# Altium schematic sheet SCH_AP-Button_LED_Sheet_V2_Altium.schdoc
size 191 x 139 mm
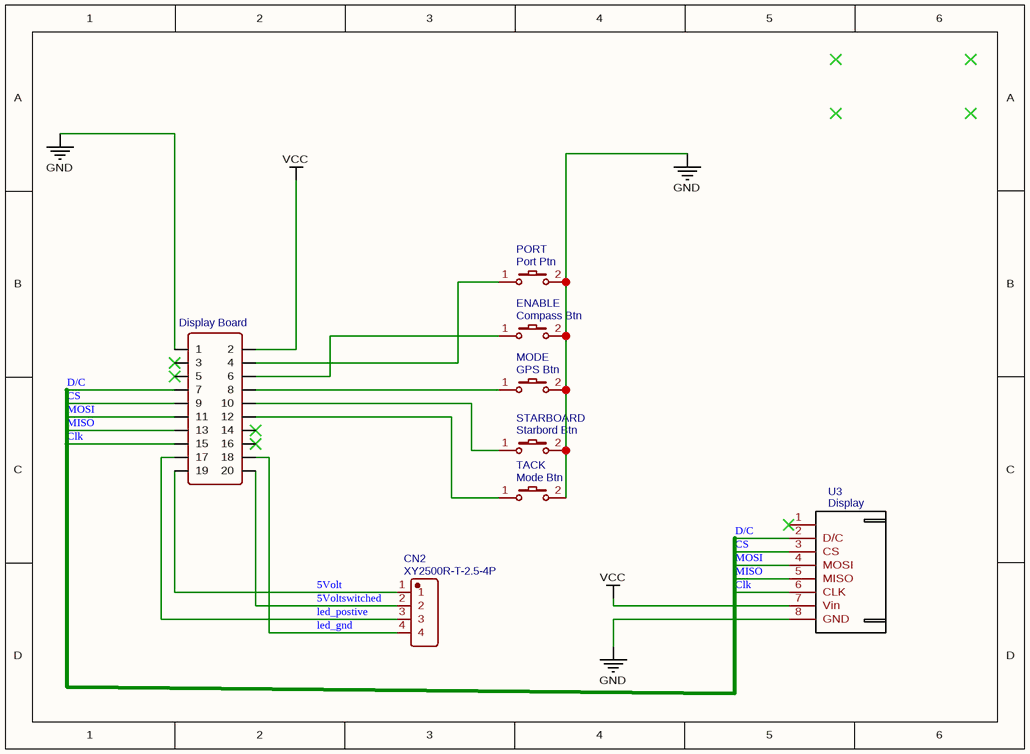
[diagram p0: SCH_AP-Button_LED_Sheet_V2_Altium.schdoc]

## Parts
BUTTON_LED1  Display Board  [HDR-M-2.54_2X10]
CN2  XY2500R-T-2.5-4P  [CONN-TH_XY2500R-T-2.5-4P]
ENABLE  Compass Btn  [KEY-SMD_2P-L6.2-W3.6-LS8.0]
MODE  GPS Btn  [KEY-SMD_2P-L6.2-W3.6-LS8.0]
PORT  Port Ptn  [KEY-SMD_2P-L6.2-W3.6-LS8.0]
STARBOARD  Starbord Btn  [KEY-SMD_2P-L6.2-W3.6-LS8.0]
TACK  Mode Btn  [KEY-SMD_2P-L6.2-W3.6-LS8.0]
U3  Display  [JST-XH-8-PIN]

## Nets
GND: BUTTON_LED1.1 ENABLE.2 MODE.2 PORT.2 STARBOARD.2 TACK.2 U3.8(GND)
VCC: BUTTON_LED1.2 U3.7(Vin)
5Volt: BUTTON_LED1.19 CN2.1
5Voltswitched: BUTTON_LED1.20 CN2.2
Clk: BUTTON_LED1.15 U3.6(CLK)
CS: BUTTON_LED1.9 U3.3(CS)
D/C: BUTTON_LED1.7 U3.2(D/C)
led_gnd: BUTTON_LED1.18 CN2.4
led_postive: BUTTON_LED1.17 CN2.3
MISO: BUTTON_LED1.13 U3.5(MISO)
MOSI: BUTTON_LED1.11 U3.4(MOSI)
NetBUTTON_LED1_4: BUTTON_LED1.4 PORT.1
NetBUTTON_LED1_6: BUTTON_LED1.6 ENABLE.1
NetBUTTON_LED1_8: BUTTON_LED1.8 MODE.1
NetBUTTON_LED1_10: BUTTON_LED1.10 STARBOARD.1
NetBUTTON_LED1_12: BUTTON_LED1.12 TACK.1

Not connected (* = marked no-connect by the designer): BUTTON_LED1 3* 5* 14* 16*; U3 1*

## Library data of the parts
BUTTON_LED1 = Display Board: Contributor: LCEDA_Lib; Supplier Part: C124359; Supplier: LCSC; spicePre: J; spiceSymbolName: HDR-M-2.54_2x10
CN2 = XY2500R-T-2.5-4P: Manufacturer: XINLAIYA(新莱亚); Contributor: LCSC; Supplier: LCSC; Supplier Part: C784963; Manufacturer Part: XY2500R-T-2.5-4P; JLCPCB Part Class: Extended Part; spicePre: C; spiceSymbolName: XY2500R-T-2.5-4P
ENABLE = Compass Btn: Manufacturer Part: K2-1107ST-A4SW-06; Contributor: LCEDA_Lib; 制造商: 韩国韩荣; Supplier Part: C118141; Supplier: LCSC; spicePre: K; spiceSymbolName: K2-3.6×6.1_SMD
MODE = GPS Btn: Manufacturer Part: K2-1107ST-A4SW-06; Contributor: LCEDA_Lib; 制造商: 韩国韩荣; Supplier Part: C118141; Supplier: LCSC; spicePre: K; spiceSymbolName: K2-3.6×6.1_SMD
PORT = Port Ptn: Manufacturer Part: K2-1107ST-A4SW-06; Contributor: LCEDA_Lib; 制造商: 韩国韩荣; Supplier Part: C118141; Supplier: LCSC; spicePre: K; spiceSymbolName: K2-3.6×6.1_SMD
STARBOARD = Starbord Btn: Manufacturer Part: K2-1107ST-A4SW-06; Contributor: LCEDA_Lib; 制造商: 韩国韩荣; Supplier Part: C118141; Supplier: LCSC; spicePre: K; spiceSymbolName: K2-3.6×6.1_SMD
TACK = Mode Btn: Manufacturer Part: K2-1107ST-A4SW-06; Contributor: LCEDA_Lib; 制造商: 韩国韩荣; Supplier Part: C118141; Supplier: LCSC; spicePre: K; spiceSymbolName: K2-3.6×6.1_SMD
U3 = Display: Contributor: loyboy; spicePre: U; spiceSymbolName: JST-XH-8-Pin